# Altium project EzPowerV4 - REV09.PrjPcb (part 7 of 7)
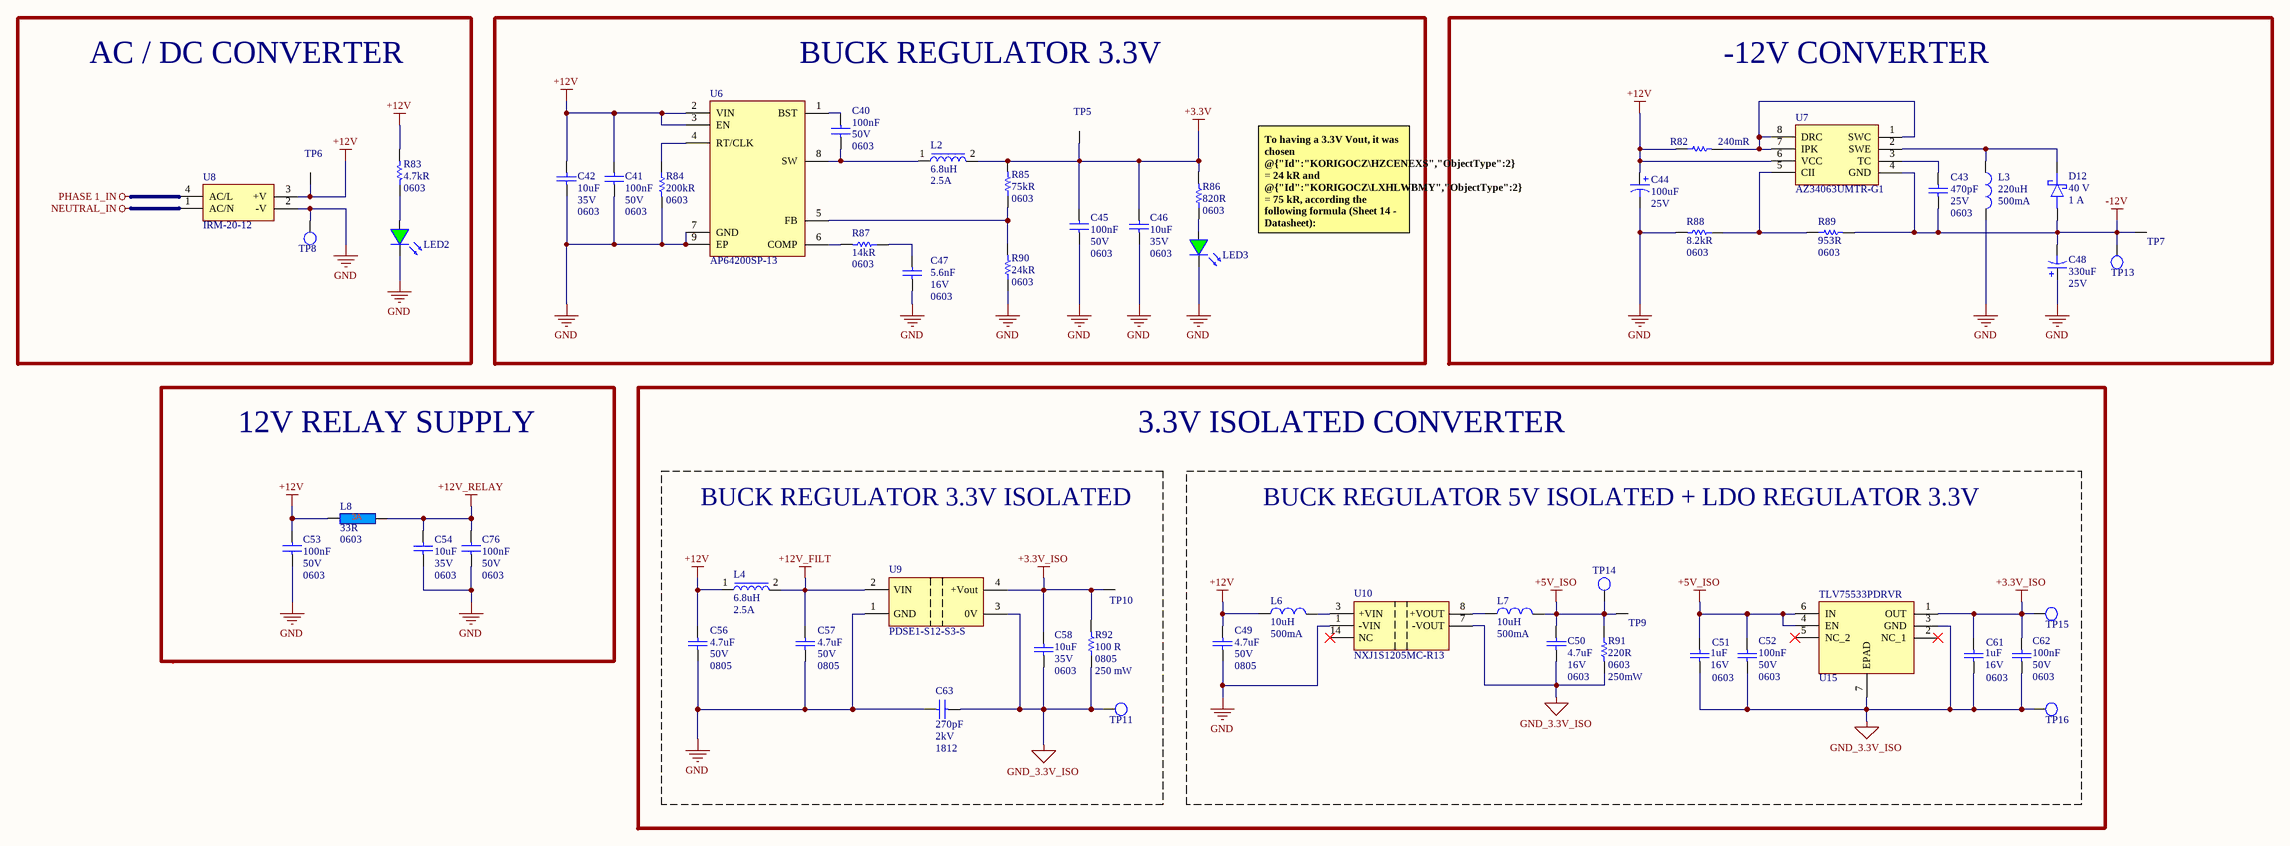
[diagram p9: Power Supply.SchDoc]

## Nets that join several sheets
+3.3V: Microcontroller (14 pins), ESP32 WI-FI Module (13 pins), PCI Express (C13.1 L1.1 R19.2 R20.2), EVSE Control and GFCI (R96.2 R97.2 R101.1), Power Supply (6 pins)
+3.3V_ISO: Microcontroller (6 pins), Power Meter (9 pins), Power Supply (8 pins)
+12V: Microcontroller (P5.1), ESP32 WI-FI Module (LS1.1 P21.1 R120.1), EVSE Control and GFCI (7 pins), Power Supply (16 pins)
+12V_RELAY: Power Meter (12 pins), Power Supply (C54.1 C76.2 L8.2)
-12V: EVSE Control and GFCI (C65.1 R105.1 U11.11), Power Supply (7 pins)
EARTH: Microcontroller (30 pins), Power Meter (22 pins), ESP32 WI-FI Module (34 pins), PCI Express (36 pins), EVSE Control and GFCI (18 pins), Power Supply (26 pins)
GND_3.3V_ISO: Microcontroller (10 pins), Power Meter (53 pins), Power Supply (16 pins)
PHASE 1_IN: Power Meter (8 pins), Power Supply (U8.4)
ATM90E_SPI1_CS_ISO: Microcontroller (R5.2 U3.9), Power Meter (R39.1 U5.37)
ATM90E_SPI1_MISO_ISO: Microcontroller (U2.12), Power Meter (R42.1 U5.39)
ATM90E_SPI1_MOSI_ISO: Microcontroller (U2.13), Power Meter (R41.1 U5.40)
ATM90E_SPI1_SCLK_ISO: Microcontroller (U2.14), Power Meter (R40.1 U5.38)
DO1_GFCI: Microcontroller (U1.42), EVSE Control and GFCI (C59.2 P16.4 R96.1)
DO2_GFCI: Microcontroller (U1.43), EVSE Control and GFCI (C60.2 P16.5 R97.1)
ESP32_UART1_RX: Microcontroller (U1.29), ESP32 WI-FI Module (R133.2)
ESP32_UART1_TX: Microcontroller (U1.32), ESP32 WI-FI Module (R132.2)
ESP32_UART2_RX: ESP32 WI-FI Module (U12.38), PCI Express (R23.2)
ESP32_UART2_TX: ESP32 WI-FI Module (U12.39), PCI Express (R22.2)
NetC22_1: Microcontroller (U3.12), Power Meter (C22.1 R34.1 U5.41)
NetC69_1: Microcontroller (U1.20), EVSE Control and GFCI (C69.1 D16.1 R106.2)
NetR10_2: Microcontroller (R10.2 U3.15), Power Meter (U5.33)
NetR15_2: Microcontroller (R15.2 U3.13), Power Meter (U5.34)
NetR21_1: ESP32 WI-FI Module (U12.31), PCI Express (R21.1)
NetR24_1: ESP32 WI-FI Module (U12.32), PCI Express (R24.1)
NetR30_1: Microcontroller (U1.40), Power Meter (R30.1)
NetR31_1: Microcontroller (U1.41), Power Meter (R31.1)
NetR35_1: Microcontroller (U1.1), Power Meter (R35.1)
NetR36_1: Microcontroller (U1.39), Power Meter (R36.1)
NetU1_30: Microcontroller (U1.30), EVSE Control and GFCI (U11.3)
NetU4_3: Microcontroller (U4.3), Power Meter (U5.29)
NetU4_5: Microcontroller (U4.5), Power Meter (U5.30)
NetU4_7: Microcontroller (U4.7), Power Meter (U5.31)
SELF_TEST_GFCI_EN: Microcontroller (U1.44), EVSE Control and GFCI (R98.2)
STM nRST: Microcontroller (5 pins), ESP32 WI-FI Module (R134.2)
STM_SWCLK-BOOT0: Microcontroller (P2.4 P4.3 R4.1 U1.36), ESP32 WI-FI Module (R135.2)

## Assembly variants
DC/DC 12V - 3.3V ISO: not fitted C49 C50 C51 C52 C61 C62 C75 L6 L7 P2 R20 R91 TP9 U10 U15
DC/DC 12V - 5V ISO: not fitted C56 C57 C58 C63 C73 C75 C79 C80 C81 C82 L4 P2 R20 R92 R93 R94 R114 R130 R131 U9 U14